# EAGLE design AD8428_shield (EAGLE 7.2.0)
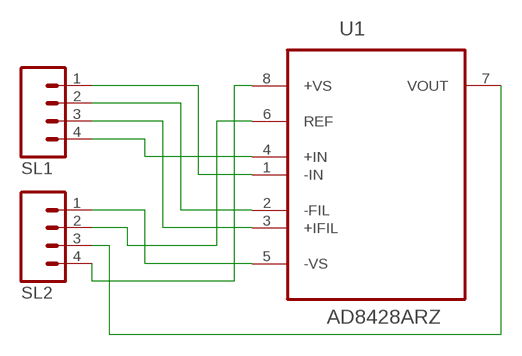
[diagram p0: schematic, sheet 1]

## Parts
SL1  M04  [04P]
SL2  M04  [04P]
U1  AD8428ARZ  [SOIC127P600X175-8N]

## Nets
N$1: SL1.1 U1.1(-IN)
N$2: SL1.2 U1.2(-FIL)
N$3: SL1.3 U1.3(+IFIL)
N$4: SL1.4 U1.4(+IN)
N$5: SL2.1 U1.5(-VS)
N$6: SL2.2 U1.6(REF)
N$7: SL2.3 U1.7(VOUT)
N$8: SL2.4 U1.8(+VS)

## Library data of the parts
SL1 SL2 = con-amp-quick:M04: AMP QUICK CONNECTOR; OC_FARNELL: unknown; OC_NEWARK: unknown
U1 = AD8428:AD8428ARZ: Instrumentation Amplifier; MPN: AD8428ARZ; OC_FARNELL: 2065944; OC_NEWARK: 67T0293; PACKAGE: SOIC-8; SUPPLIER: Analog Devices

## Board
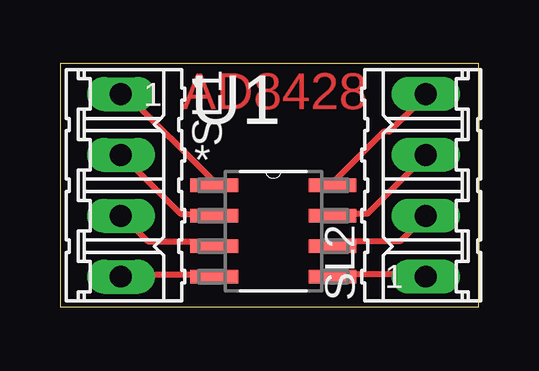
[diagram p1: board, top side]

Size 17.45 x 10.15 mm. Coordinates in mm from the lower left corner, seen from the top.
Outline: 0,0 17.45,0 17.45,10.15 0,10.15 0,0
Copper layers (1*16): Top 0.035mm / dielectric 1.5mm / Bottom 0.035mm
Design rules "default": minimum track width 10mil, minimum drill 24mil, track to track 8mil, track to pad 8mil, pad to pad 8mil, via to via 8mil, smd to smd 8mil, copper to edge 40mil, drill to drill 8mil, minimum pad ring 10mil, minimum via ring 8mil, stop-mask expansion 4mil, vias tented up to drill 0mil, thermal gap 10mil

### Footprints (pad centres in the part's own frame; a part is rotated, then mirrored left to right if it is on the bottom)
04P = drill 0.914 long: 1 -3.81,0; 2 -1.27,0; 3 1.27,0; 4 3.81,0
SOIC127P600X175-8N = smd 1.981 x 0.559: 1 -2.464,1.905; 2 -2.464,0.635; 3 -2.464,-0.635; 4 -2.464,-1.905; 5 2.464,-1.905; 6 2.464,-0.635; 7 2.464,0.635; 8 2.464,1.905

### Placement (x,y rotation side)
SL1  2.54,5.08 270 top
SL2  15.24,5.08 90 top
U1  8.89,3.17 0 top

### Tracks (layer width: path | path; a pad name or v marks a point on that pad's centre or on a via)
N$1
  Top 0.254: U1.1 6.4,5.26 2.74,8.91 SL1.1
N$2
  Top 0.254: U1.2 6.4,3.89 5.03,3.89 2.74,6.17 SL1.2
N$3
  Top 0.254: U1.3 6.4,2.74 3.66,2.74 2.74,3.66 SL1.3
N$4
  Top 0.254: U1.4 6.4,1.37 2.74,1.37 SL1.4
N$5
  Top 0.254: U1.5 11.43,1.37 15.09,1.37 SL2.1
N$6
  Top 0.254: SL2.2 14.17,2.74 11.43,2.74 U1.6
N$7
  Top 0.254: U1.7 11.43,3.89 12.8,3.89 15.09,6.17 SL2.3
N$8
  Top 0.254: U1.8 11.43,5.26 13.49,7.32 13.72,7.32 15.09,8.69 SL2.4

### Text on the board
Top: AD8428